# EAGLE design linistepper with aligned transistors_my_version2 (EAGLE 7.6.0)
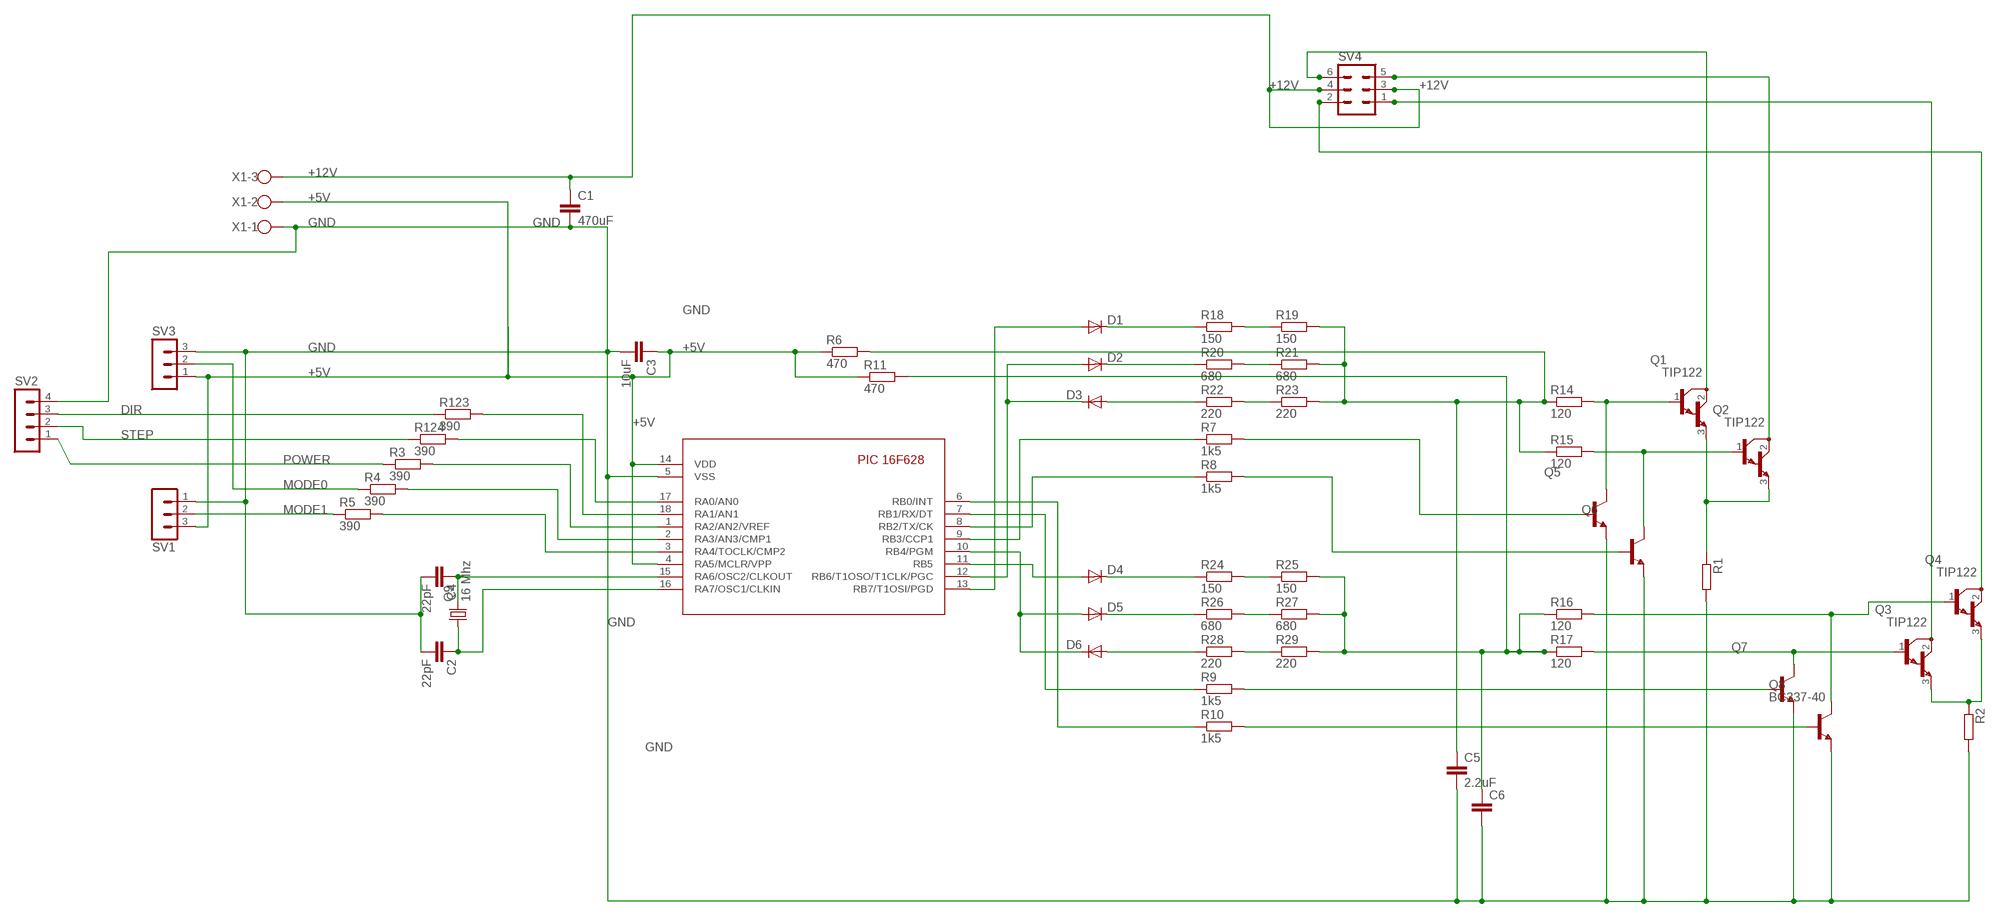
[diagram p0: schematic, sheet 1]

## Parts
C1  470uF  C-EU050-045X075  [C050-045X075]
C2  22pF  C-EU025-024X044  [C025-024X044]
C3  10uF  C-EU025-040X050  [C025-040X050]
C4  22pF  C-EU025-024X044  [C025-024X044]
C5  2.2uF  C-EU050-024X044  [C050-024X044]
C6  C-EU050-024X044  [C050-024X044]
D1  1N4148  [DO35-10]
D2  1N4148  [DO35-10]
D3  1N4148  [DO35-10]
D4  1N4148  [DO35-10]
D5  1N4148  [DO35-10]
D6  1N4148  [DO35-10]
Q1  TIP122  [TO220]
Q2  TIP122  [TO220]
Q3  TIP122  [TO220]
Q4  TIP122  [TO220]
Q5  BC337-40  [TO92]
Q6  BC337-40  [TO92]
Q7  BC337-40  [TO92]
Q8  BC337-40  [TO92]
Q9  16 Mhz  CRYTALHC49S  [HC49/S]
R1  R-EU_0922/22  [0922/22]
R2  R-EU_0922/22  [0922/22]
R3  390  R-EU_0204/7  [0204/7]
R4  390  R-EU_0204/7  [0204/7]
R5  390  R-EU_0207/5V  [0207/5V]
R6  470  R-EU_0207/10  [0207/10]
R7  1k5  R-EU_0207/10  [0207/10]
R8  1k5  R-EU_0207/10  [0207/10]
R9  1k5  R-EU_0207/7  [0207/7]
R10  1k5  R-EU_0207/5V  [0207/5V]
R11  470  R-EU_0207/7  [0207/7]
R14  120  R-EU_0207/10  [0207/10]
R15  120  R-EU_0207/10  [0207/10]
R16  120  R-EU_0207/5V  [0207/5V]
R17  120  R-EU_0207/7  [0207/7]
R18  150  R-EU_0207/2V  [0207/2V]
R19  150  R-EU_0207/2V  [0207/2V]
R20  680  R-EU_0207/2V  [0207/2V]
R21  680  R-EU_0207/2V  [0207/2V]
R22  220  R-EU_0207/2V  [0207/2V]
R23  220  R-EU_0207/2V  [0207/2V]
R24  150  R-EU_0207/2V  [0207/2V]
R25  150  R-EU_0207/2V  [0207/2V]
R26  680  R-EU_0207/2V  [0207/2V]
R27  680  R-EU_0207/2V  [0207/2V]
R28  220  R-EU_0207/2V  [0207/2V]
R29  220  R-EU_0207/2V  [0207/2V]
R123  390  R-EU_0207/2V  [0207/2V]
R124  390  R-EU_0207/2V  [0207/2V]
SV1  MA03-1  [MA03-1]
SV2  MA04-1  [MA04-1]
SV3  MA03-1  [MA03-1]
SV4  MA03-2  [MA03-2]
U$1  16F628  [PIC16F628-18-LEAD-PDIP]
X1  W237-103  [W237-103]

## Nets
+5V: C3.1 R6.1 R11.1 SV1.3 SV3.1 U$1.4(RA5/MCLR/VPP) U$1.14(VDD) X1.2
+12V: C1.1 SV4.3 SV4.4 X1.3
DIR: R123.1 SV2.3
GND: C1.2 C2.2 C3.2 C4.2 C5.2 C6.2 Q5.1(E) Q6.1(E) Q7.1(E) Q8.1(E) R1.2 R2.2 SV1.1 SV2.4 SV3.3 U$1.5(VSS) X1.1
MODE0: R4.1 SV3.2
MODE1: R5.1 SV1.2
N$1: R18.2 R19.1
N$2: C5.1 R6.2 R14.1 R15.1 R19.2 R21.2 R23.2
N$3: R20.2 R21.1
N$5: Q1.1(B) Q5.3(C) R14.2
N$6: Q2.1(B) Q6.3(C) R15.2
N$7: D1.C R18.1
N$8: D2.C R20.1
N$9: D3.A R22.1
N$10: D1.A U$1.13(RB7/T1OSI/PGD)
N$11: D2.A D3.C U$1.12(RB6/T1OSO/T1CLK/PGC)
N$12: R8.1 U$1.8(RB2/TX/CK)
N$13: R7.1 U$1.9(RB3/CCP1)
N$14: Q5.2(B) R7.2
N$15: Q6.2(B) R8.2
N$16: Q1.3(E) Q2.3(E) R1.1
N$17: R3.2 U$1.1(RA2/AN2/VREF)
N$18: R4.2 U$1.2(RA3/AN3/CMP1)
N$19: R24.2 R25.1
N$20: D5.C R26.1
N$21: R26.2 R27.1
N$22: D6.A R28.1
N$23: R28.2 R29.1
N$24: D4.A U$1.11(RB5)
N$25: D5.A D6.C U$1.10(RB4/PGM)
N$26: R9.1 U$1.7(RB1/RX/DT)
N$27: R10.1 U$1.6(RB0/INT)
N$28: C6.1 R11.2 R16.1 R17.1 R25.2 R27.2 R29.2
N$29: Q4.1(B) Q8.3(C) R16.2
N$30: Q8.2(B) R10.2
N$31: Q3.1(B) Q7.3(C) R17.2
N$32: Q7.2(B) R9.2
N$33: Q3.3(E) Q4.3(E) R2.1
N$34: Q1.2(C) SV4.6
N$35: Q2.2(C) SV4.5
N$36: Q3.2(C) SV4.1
N$37: Q4.2(C) SV4.2
N$39: R124.2 U$1.17(RA0/AN0)
N$41: R123.2 U$1.18(RA1/AN1)
N$43: C2.1 Q9.1 U$1.16(RA7/OSC1/CLKIN)
N$44: C4.1 Q9.2 U$1.15(RA6/OSC2/CLKOUT)
N$48: R5.2 U$1.3(RA4/TOCLK/CMP2)
POWER: R3.1 SV2.1
R23: R22.2 R23.1
R24: D4.C R24.1
STEP: R124.1 SV2.2

## Library data of the parts
C1-C6 = rcl:C-EU: CAPACITOR, European symbol
D1-D6 = diode:1N4148: DIODE high speed (Philips)
Q1-Q4 = transistor-npn_no_hole:TIP122*: NPN Darlington Transistor
Q5-Q8 = transistor-npn:BC337*: NPN Transistor
Q9 = crystal:CRYTAL: CRYSTAL
R1-R8 R14 R15 R18-R29 R123 R124 = rcl:R-EU_: RESISTOR, European symbol
R9-R11 R16 R17 = resistor:R-EU_: RESISTOR, European symbol
SV1 SV3 = con-lstb:MA03-1: PIN HEADER
SV2 = con-lstb:MA04-1: PIN HEADER; OC_FARNELL: unknown; OC_NEWARK: unknown
SV4 = con-lstb:MA03-2: PIN HEADER
U$1 = pic16f6xx:16F628: Microchip component PIC 16F628 Eric Magraner - eric_magraner@yahoo.fr 03/2004
X1 = con-wago-500:W237-103: WAGO SCREW CLAMP

## Board
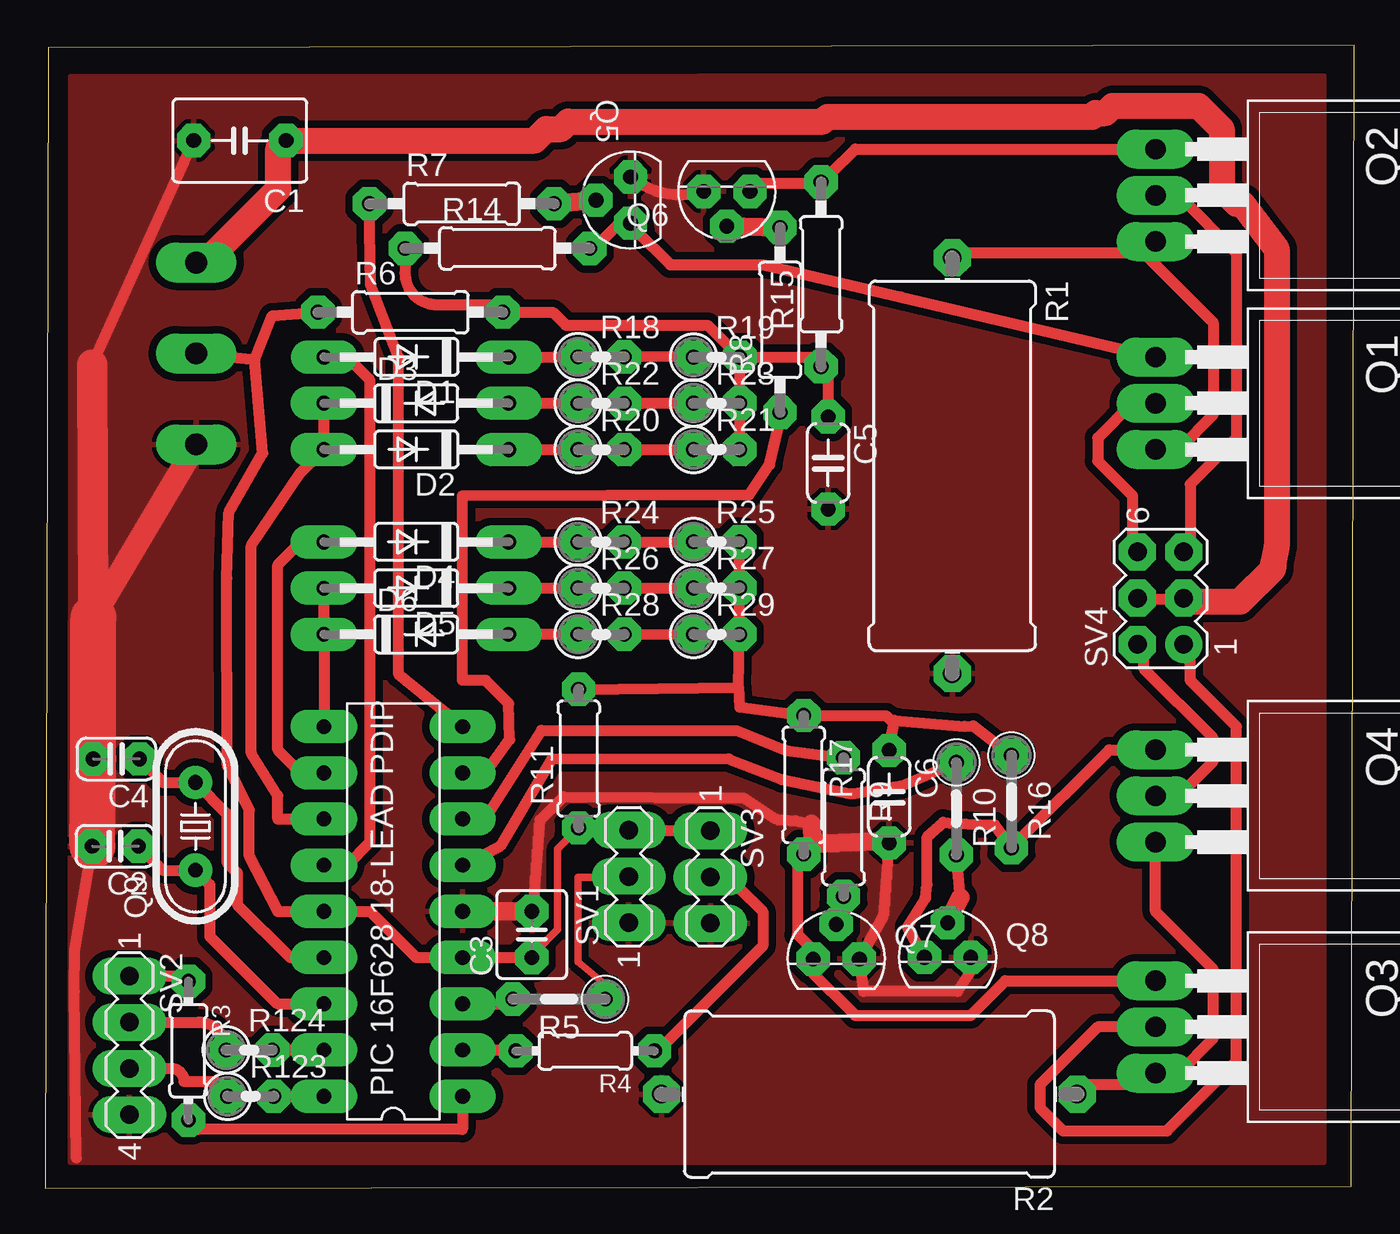
[diagram p1: board, top side]
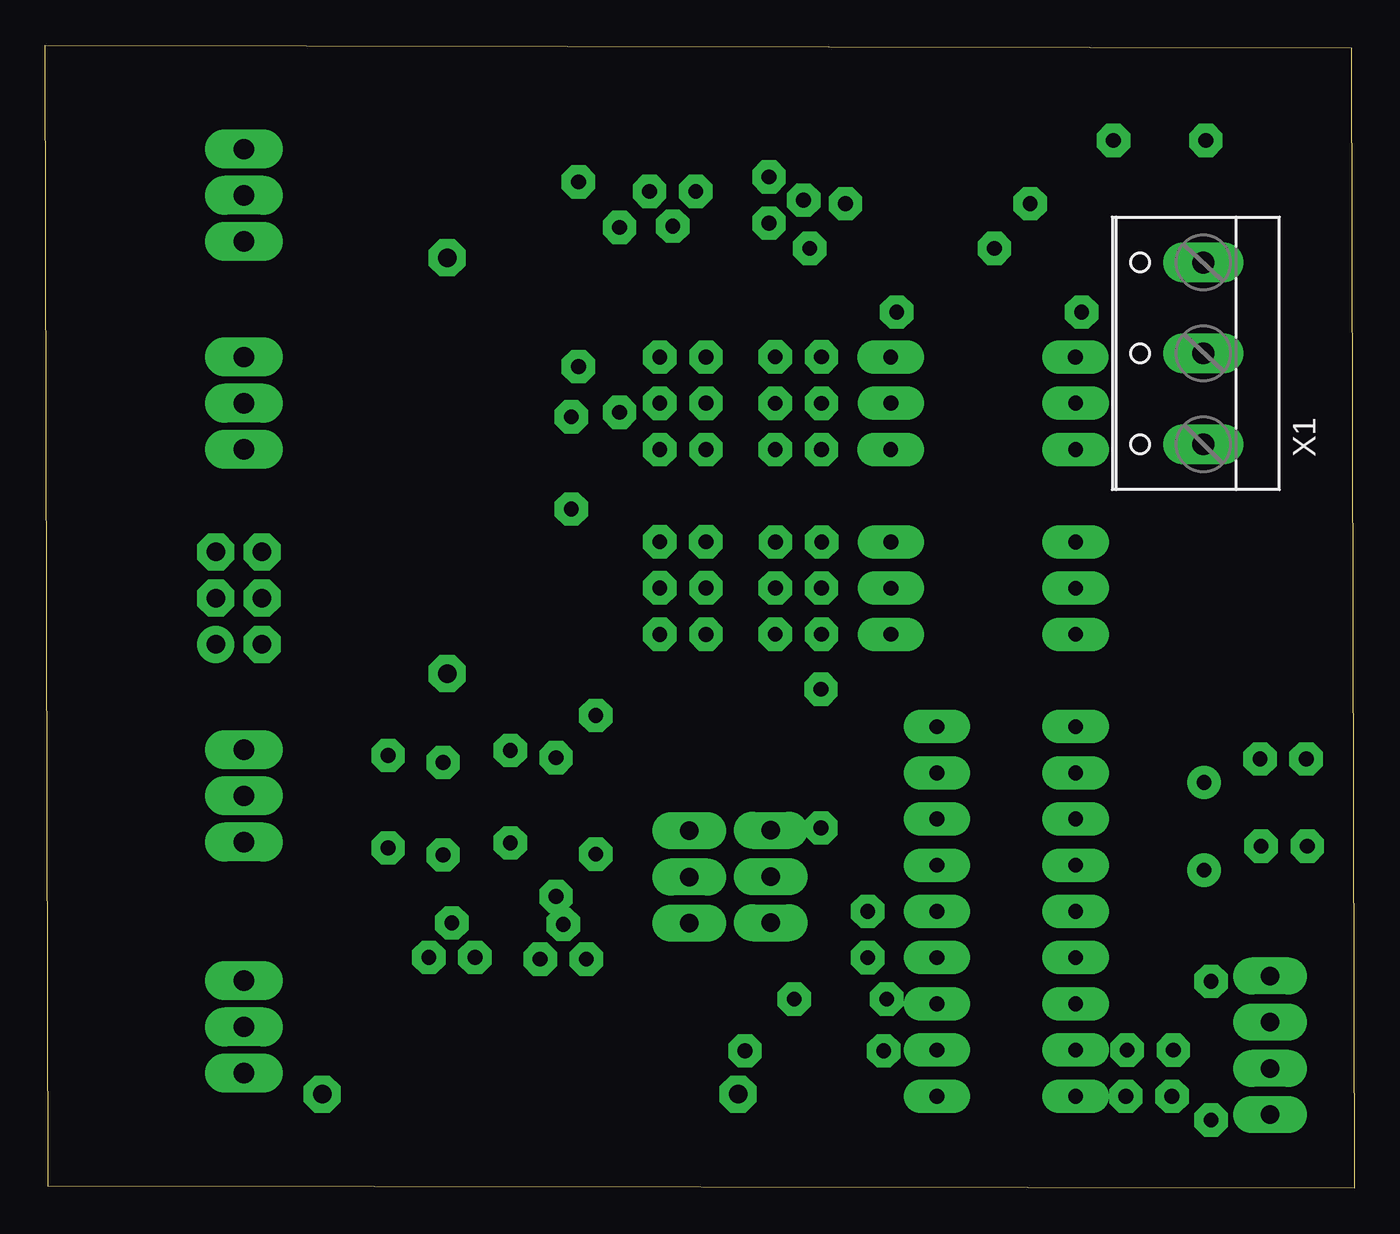
[diagram p2: board, bottom side, seen from below]

Size 71.94 x 62.84 mm. Coordinates in mm from the lower left corner, seen from the top.
Outline: 0,0 71.8,0.12 71.94,62.84 0.14,62.72 0,0
Copper layers (1*16): Top 0.035mm / dielectric 1.5mm / Bottom 0.035mm
Design rules "default *": minimum track width 24mil, minimum drill 24mil, track to track 16mil, track to pad 15mil, pad to pad 8mil, via to via 8mil, smd to smd 8mil, copper to edge 40mil, drill to drill 8mil, minimum pad ring 20mil, minimum via ring 8mil, stop-mask expansion 4mil, vias tented up to drill 0mil, thermal gap 10mil

### Footprints (pad centres in the part's own frame; a part is rotated, then mirrored left to right if it is on the bottom)
C050-045X075 = drill 0.813 octagon: 1 -2.54,0; 2 2.54,0
C025-024X044 = drill 0.813 octagon: 1 -1.27,0; 2 1.27,0
C025-040X050 = drill 0.813 octagon: 1 -1.27,0; 2 1.27,0
C050-024X044 = drill 0.813 octagon: 1 -2.54,0; 2 2.54,0
DO35-10 = drill 0.813 long: A 5.08,0; C -5.08,0
TO220 = drill 1.118 long: 1 -2.54,-6.35; 2 0,-6.35; 3 2.54,-6.35
TO92 = drill 0.813 octagon: 1 1.27,0; 2 0,1.905; 3 -1.27,0
HC49/S = drill 0.813: 1 -2.413,0; 2 2.413,0
0922/22 = drill 1.016 octagon: 1 -11.43,0; 2 11.43,0
0204/7 = drill 0.813 octagon: 1 -3.81,0; 2 3.81,0
0207/5V = drill 0.813 octagon: 1 -2.54,0; 2 2.54,0
0207/10 = drill 0.813 octagon: 1 -5.08,0; 2 5.08,0
0207/7 = drill 0.813 octagon: 1 -3.81,0; 2 3.81,0
0207/2V = drill 0.813 octagon: 1 -1.27,0; 2 1.27,0
MA03-1 = drill 1.016 long: 1 -2.54,0; 2 0,0; 3 2.54,0
MA04-1 = drill 1.016 long: 1 -3.81,0; 2 -1.27,0; 3 1.27,0; 4 3.81,0
MA03-2 = drill 1.016: 1 -2.54,-1.27 | drill 1.016 octagon: 2 -2.54,1.27; 3 0,-1.27; 4 0,1.27; 5 2.54,-1.27; 6 2.54,1.27
PIC16F628-18-LEAD-PDIP = drill 0.813 long: 1 -10.16,-3.81; 2 -7.62,-3.81; 3 -5.08,-3.81; 4 -2.54,-3.81; 5 0,-3.81; 6 2.54,-3.81; 7 5.08,-3.81; 8 7.62,-3.81; 9 10.16,-3.81; 10 10.16,3.81; 11 7.62,3.81; 12 5.08,3.81; 13 2.54,3.81; 14 0,3.81; 15 -2.54,3.81; 16 -5.08,3.81; 17 -7.62,3.81; 18 -10.16,3.81
W237-103 = drill 1.194 long: 1 -5,-1.29; 2 0,-1.29; 3 5,-1.29

### Placement (x,y rotation side)
C1  10.69,57.61 180 top
C2  3.84,18.82 180 top
C3  26.74,13.96 90 top
C4  3.9,23.61 180 top
C5  43.03,39.89 270 top
C6  46.39,21.54 270 top
D1  20.4,45.71 180 top
D2  20.39,40.63 180 top
D3  20.38,43.17 0 top
D4  20.39,35.55 180 top
D5  20.39,33 180 top
D6  20.38,30.47 0 top
Q1  67.38,43.17 270 top
Q2  67.38,54.6 270 top
Q3  67.38,8.88 270 top
Q4  67.38,21.58 270 top
Q5  32.17,54.34 90.1 top
Q6  37.46,54.82 180 top
Q7  43.47,12.61 0 top
Q8  49.6,12.7 0 top
Q9  8.24,19.91 90 top
R1  49.86,39.73 270 top
R2  45.3,5.18 180 top
R3  7.86,7.57 270 top
R4  29.67,7.56 180 top
R5  28.24,10.41 180 top
R6  20.06,48.17 0 top
R7  22.88,54.14 0 top
R8  40.39,47.75 90 top
R9  43.87,19.87 270 top
R10  50.08,20.88 270 top
R11  29.31,23.63 90 top
R14  24.85,51.69 0 top
R15  42.64,50.26 90 top
R16  53.11,21.27 270 top
R17  41.68,22.19 270 top
R18  30.55,45.72 0 top
R19  36.9,45.7 0 top
R20  30.55,40.62 0 top
R21  36.9,40.62 0 top
R22  30.55,43.17 0 top
R23  36.9,43.17 0 top
R24  30.54,35.54 0 top
R25  36.9,35.55 0 top
R26  30.54,33.01 0 top
R27  36.9,33.02 0 top
R28  30.55,30.47 0 top
R29  36.9,30.46 0 top
R123  11.28,5.07 0 top
R124  11.2,7.61 0 top
SV1  32.06,17.15 90 top
SV2  4.61,7.87 270 top
SV3  36.55,17.12 270 top
SV4  61.31,32.45 90 top
U$1  19.12,15.23 90 top
X1  9.58,45.91 90 bottom

### Tracks (layer width: path | path; a pad name or v marks a point on that pad's centre or on a via)
+5V
  Top 0.406: 26.93,12.69 26.93,13.01 28.16,14.24 28.16,18.67 R11.1
  Top 0.61: R6.1 12.47,47.98 11.77,46.25 11.51,45.54 | 11.51,45.54 X1.2 | 11.51,45.54 11.94,40.42 10.08,37.16 9.97,33.54 9.99,23.27 11.2,20.8 11.2,18.26 12.77,15.23 U$1.14 17.85,15.23 20.39,12.69 U$1.4 C3.1 26.93,12.69 | R11.1 30.55,19.64 SV1.3 36.65,19.69 SV3.1
+12V
  Top 0.61: SV4.4 60.39,32.38 62.3,32.38 SV4.3
  Top 1.422: X1.3 8.76,50.91 12.8,54.95 12.8,57.19 C1.1 26.9,57.61 27.53,58.25 28.34,58.25 28.74,58.65 42.74,58.65 43.01,58.92 57.54,58.92 57.74,59.12 58.28,59.12 58.68,59.53 63.39,59.53 64.67,58.25 64.67,54.95 65.47,54.14 65.81,54.14 67.69,51.65 67.69,35.28 67.49,34.34 67.49,34.07 65.68,32.25 62.78,32.25 SV4.3
DIR
  Top 0.61: SV2.3 6.9,6.6 arc-90 7.62,5.88 9.2,5.88 arc-90 R123.1
GND
  Top 0.254: X1.1 2.61,31.74
  Top 0.61: 1.7,1.67 1.59,10.86 1.6,13.08 C2.2 | 2.58,45.29 C1.2 | Q5.1 arc56 Q6.1 | C3.2 26.8,15.23 27.19,20.24 28.48,21.53 38.4,21.47 40.2,20.29 41.26,20.21 42.11,20.04 | C6.2 46.06,15 Q7.1 44.99,10.83 50.14,10.83 50.87,11.97 Q8.1
  Top 1.016: C3.2 U$1.5 | 45.77,19.07 42.19,18.95 42.11,20.04
  Top 1.27: 2.63,31.37 X1.1
  Top 1.676: 2.63,31.37 2.58,45.29
  Top 2.54: C2.2 C4.2 2.63,31.37
  pour Top (isolate 0.406): 1.38,61.11 70.28,61.17 70.28,1.45 1.36,1.45
MODE0
  Top 0.61: R4.1 33.72,7.61 39.44,13.33 39.44,15.23 38.17,16.5 36.9,16.5 SV3.2
MODE1
  Top 0.406: R5.1 30.78,11.21 29.29,12.47 29.29,17.09 29.61,17.09 30.22,17.09 30.41,17.28 31.93,17.28 SV1.2
N$1
  Top 0.254: R19.1
  Top 0.61: R19.1 R18.2
N$2
  Top 0.61: R14.1 19.77,50.33 arc90 21.51,48.59 24.99,48.59 arc90 R6.2 27.9,48.17 28.61,47.46 36.41,47.46 R19.2 | R19.2 42.12,45.7 R15.1 43.01,45.18 C5.1 | R19.2 R23.2 R21.2
N$3
  Top 0.254: R21.1
  Top 0.61: R20.2 R21.1
N$5
  Top 0.61: R14.2 30.55,52.06 31.82,53.33 Q5.3 32.45,52.7 34.36,50.79 39.44,50.79 47.04,49.01 Q1.1
N$6
  Top 0.61: Q6.3 38.8,55.24 42.61,55.24 R15.2 43.25,55.87 44.52,57.14 Q2.1
N$7
  Top 0.61: D1.C 26.74,45.71 28.01,45.71 R18.1
N$8
  Top 0.61: D2.C 26.74,40.63 28.01,40.63 R20.1
N$9
  Top 0.61: R22.1 28.01,43.17 26.74,43.17 D3.A
N$10
  Top 0.61: U$1.13 16.58,17.77 17.85,19.04 17.85,44.44 16.58,45.71 D1.A
N$11
  Top 0.254: D2.A
  Top 0.61: D2.A 15.31,41.9 D3.C | U$1.12 12.77,20.31 12.77,21.58 11.31,23.92 11.31,35.35 14.04,39.36 D2.A
N$12
  Top 0.61: U$1.8 24.2,22.85 25.52,24.68 25.47,26.66 24.2,27.93 22.93,27.93 22.93,38.09 38.7,38.15 39.81,39.79 40.45,42.59 R8.1
N$13
  Top 0.61: U$1.9 19.42,28.25 19.42,45.68 17.86,49.7 R7.1
N$14
  Top 1.016: R7.2 Q5.2
N$15
  Top 1.016: R8.2 Q6.2
N$16
  Top 0.61: 60.39,51.43 50.23,51.43 R1.1 | Q1.3 62.3,40.63 64.2,42.54 64.2,47.62 60.39,51.43 | 60.39,51.43 Q2.3
N$17
  Top 0.61: U$1.1 22.93,3.24 8.38,3.24 arc-90 R3.2
N$18
  Top 0.61: U$1.2 25.47,7.61 R4.2
N$19
  Top 0.254: R25.1
  Top 0.61: R24.2 R25.1
N$20
  Top 0.61: D5.C 26.74,33.01 28.01,33.01 R26.1
N$21
  Top 0.254: R27.1
  Top 0.61: R26.2 R27.1
N$22
  Top 0.61: D6.A 26.74,30.47 28.01,30.47 R28.1
N$23
  Top 0.254: R29.1
  Top 0.61: R28.2 R29.1
N$24
  Top 0.61: U$1.11 14.04,22.85 12.77,24.12 12.77,34.28 14.04,35.55 D4.A
N$25
  Top 0.254: D5.A | D6.C
  Top 0.61: U$1.10 D6.C D5.A
N$26
  Top 0.61: U$1.7 24.29,20.48 27.27,25.19 38.01,25.17 40.71,24.08 R9.1
N$27
  Top 0.61: R10.1 47.11,22.15 44.31,21.69 40.49,22.48 37.56,23.62 27.86,23.64 25.02,18.84 U$1.6
N$28
  Top 0.254: R25.2 | R29.2
  Top 0.61: R25.2 R27.2 R29.2 38.11,27.54 | R11.2 38.11,27.54 | 38.11,27.54 38.17,26.46 R17.1 46.2,26 46.64,25.56 | C6.1 46.64,25.56 | 46.64,25.56 46.67,25.74 50.54,25.41 51.02,25.43 R16.1
N$29
  Top 0.61: Q8.3 47.39,14.37 48.39,15.95 48.47,16.69 48.47,19.33 49.36,20.13 49.95,20.06 52.18,19.99 R16.2 53.41,19.04 58.49,24.12 Q4.1
N$30
  Top 0.61: 50.3,16.01 R10.2
  Top 1.016: Q8.2 50.3,16.01
N$31
  Top 0.61: R17.2 41.34,17.77 41.34,13.96 41.98,13.33 41.98,12.69 Q7.3 41.98,12.06 44.52,9.52 50.87,9.52 52.77,11.42 Q3.1
N$32
  Top 0.61: R9.2 44.02,15.39 43.85,14.31 43.86,14.68 Q7.2
N$33
  Top 0.61: R2.1 57.22,5.71 60.39,5.71 Q3.3 62.3,6.34 64.2,8.25 64.2,12.06 61.03,15.23 Q4.3
N$34
  Top 0.61: Q1.2 59.76,43.17 57.85,41.27 57.85,40 59.76,38.09 59.76,35.55 SV4.6
N$35
  Top 0.61: Q2.2 62.3,54.6 65.47,51.43 65.47,41.27 62.93,38.73 62.93,35.55 SV4.5
N$36
  Top 0.61: Q3.2 57.85,8.88 54.68,5.71 54.68,4.44 55.95,3.17 61.66,3.17 65.47,6.98 65.47,25.39 62.93,27.93 62.93,29.84 SV4.1
N$37
  Top 0.61: Q4.2 62.3,21.58 64.2,23.49 64.2,24.76 60.39,28.57 60.39,29.84 SV4.2
N$39
  Top 0.61: R124.2 U$1.17
N$41
  Top 0.61: R123.2 U$1.18
N$43
  Top 0.61: C2.1 6.43,17.5 Q9.1 9.04,16.7 9.04,13.85 12.74,10.15 U$1.16
N$44
  Top 0.61: C4.1 6.46,22.32 Q9.2 9.97,20.6 9.97,17.93 10.55,17.35 10.55,15.6 13.46,12.69 U$1.15
N$48
  Top 0.61: U$1.3 26.07,10.15 arc-90 R5.2
POWER
  Top 0.61: SV2.1 7.56,11.68 arc-90 R3.1
R23
  Top 0.254: R23.1
  Top 0.61: R22.2 R23.1
R24
  Top 0.61: D4.C 26.74,35.55 28.01,35.55 R24.1
STEP
  Top 0.61: SV2.2 8.4,9.14 arc-90 R124.1